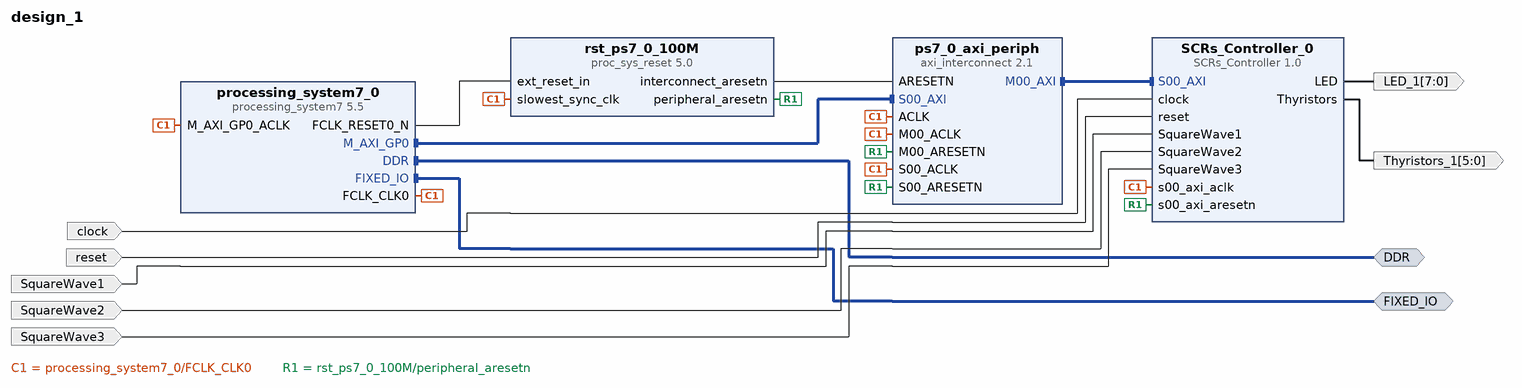
[diagram p0: block diagram of the top level]
# Vivado block design design_1, xc7z020clg484-1, Vivado 2016.4
create_bd_design design_1

create_bd_intf_port -mode Master -vlnv xilinx.com:interface:ddrx_rtl:1.0 DDR
create_bd_intf_port -mode Master -vlnv xilinx.com:display_processing_system7:fixedio_rtl:1.0 FIXED_IO
create_bd_port -dir O -from 5 -to 0 Thyristors_1
create_bd_port -dir O -from 7 -to 0 LED_1
create_bd_port -dir I -type clk clock
create_bd_port -dir I -type rst reset
create_bd_port -dir I SquareWave1
create_bd_port -dir I SquareWave2
create_bd_port -dir I SquareWave3

create_bd_cell -type ip -vlnv xilinx.com:ip:processing_system7:5.5 processing_system7_0
set_property -dict {CONFIG.preset ZedBoard} [get_bd_cells processing_system7_0]
create_bd_cell -type ip -vlnv xilinx.com:ip:axi_interconnect:2.1 ps7_0_axi_periph
set_property -dict {CONFIG.NUM_MI 1} [get_bd_cells ps7_0_axi_periph]
create_bd_cell -type ip -vlnv xilinx.com:ip:proc_sys_reset:5.0 rst_ps7_0_100M
create_bd_cell -type ip -vlnv xilinx.com:user:SCRs_Controller:1.0 SCRs_Controller_0

# ---- connections ----

connect_bd_intf_net [get_bd_intf_pins processing_system7_0/M_AXI_GP0] [get_bd_intf_pins ps7_0_axi_periph/S00_AXI]
connect_bd_intf_net [get_bd_intf_pins ps7_0_axi_periph/M00_AXI] [get_bd_intf_pins SCRs_Controller_0/S00_AXI]
connect_bd_intf_net [get_bd_intf_ports DDR] [get_bd_intf_pins processing_system7_0/DDR]
connect_bd_intf_net [get_bd_intf_ports FIXED_IO] [get_bd_intf_pins processing_system7_0/FIXED_IO]
connect_bd_net [get_bd_pins processing_system7_0/FCLK_CLK0] \
  [get_bd_pins processing_system7_0/M_AXI_GP0_ACLK] [get_bd_pins rst_ps7_0_100M/slowest_sync_clk] \
  [get_bd_pins ps7_0_axi_periph/S00_ACLK] [get_bd_pins ps7_0_axi_periph/ACLK] [get_bd_pins ps7_0_axi_periph/M00_ACLK] \
  [get_bd_pins SCRs_Controller_0/s00_axi_aclk]
connect_bd_net [get_bd_pins processing_system7_0/FCLK_RESET0_N] [get_bd_pins rst_ps7_0_100M/ext_reset_in]
connect_bd_net [get_bd_pins rst_ps7_0_100M/peripheral_aresetn] \
  [get_bd_pins ps7_0_axi_periph/S00_ARESETN] [get_bd_pins ps7_0_axi_periph/M00_ARESETN] \
  [get_bd_pins SCRs_Controller_0/s00_axi_aresetn]
connect_bd_net [get_bd_pins rst_ps7_0_100M/interconnect_aresetn] [get_bd_pins ps7_0_axi_periph/ARESETN]
connect_bd_net [get_bd_pins SCRs_Controller_0/Thyristors] [get_bd_ports Thyristors_1]
connect_bd_net [get_bd_pins SCRs_Controller_0/LED] [get_bd_ports LED_1]
connect_bd_net [get_bd_ports clock] [get_bd_pins SCRs_Controller_0/clock]
connect_bd_net [get_bd_ports reset] [get_bd_pins SCRs_Controller_0/reset]
connect_bd_net -net SquareWave1_1 [get_bd_ports SquareWave1] [get_bd_pins SCRs_Controller_0/SquareWave1]
connect_bd_net -net SquareWave2_1 [get_bd_ports SquareWave2] [get_bd_pins SCRs_Controller_0/SquareWave2]
connect_bd_net -net SquareWave3_1 [get_bd_ports SquareWave3] [get_bd_pins SCRs_Controller_0/SquareWave3]

# ---- address map ----
assign_bd_address -offset 0x43C00000 -range 64K -target_address_space [get_bd_addr_spaces processing_system7_0/Data] [get_bd_addr_segs SCRs_Controller_0/S00_AXI/S00_AXI_reg]

validate_bd_design
save_bd_design
